# Altium schematic sheet Mainboard.SchDoc
size A4; SheetNumber: 1; SheetTotal: 2
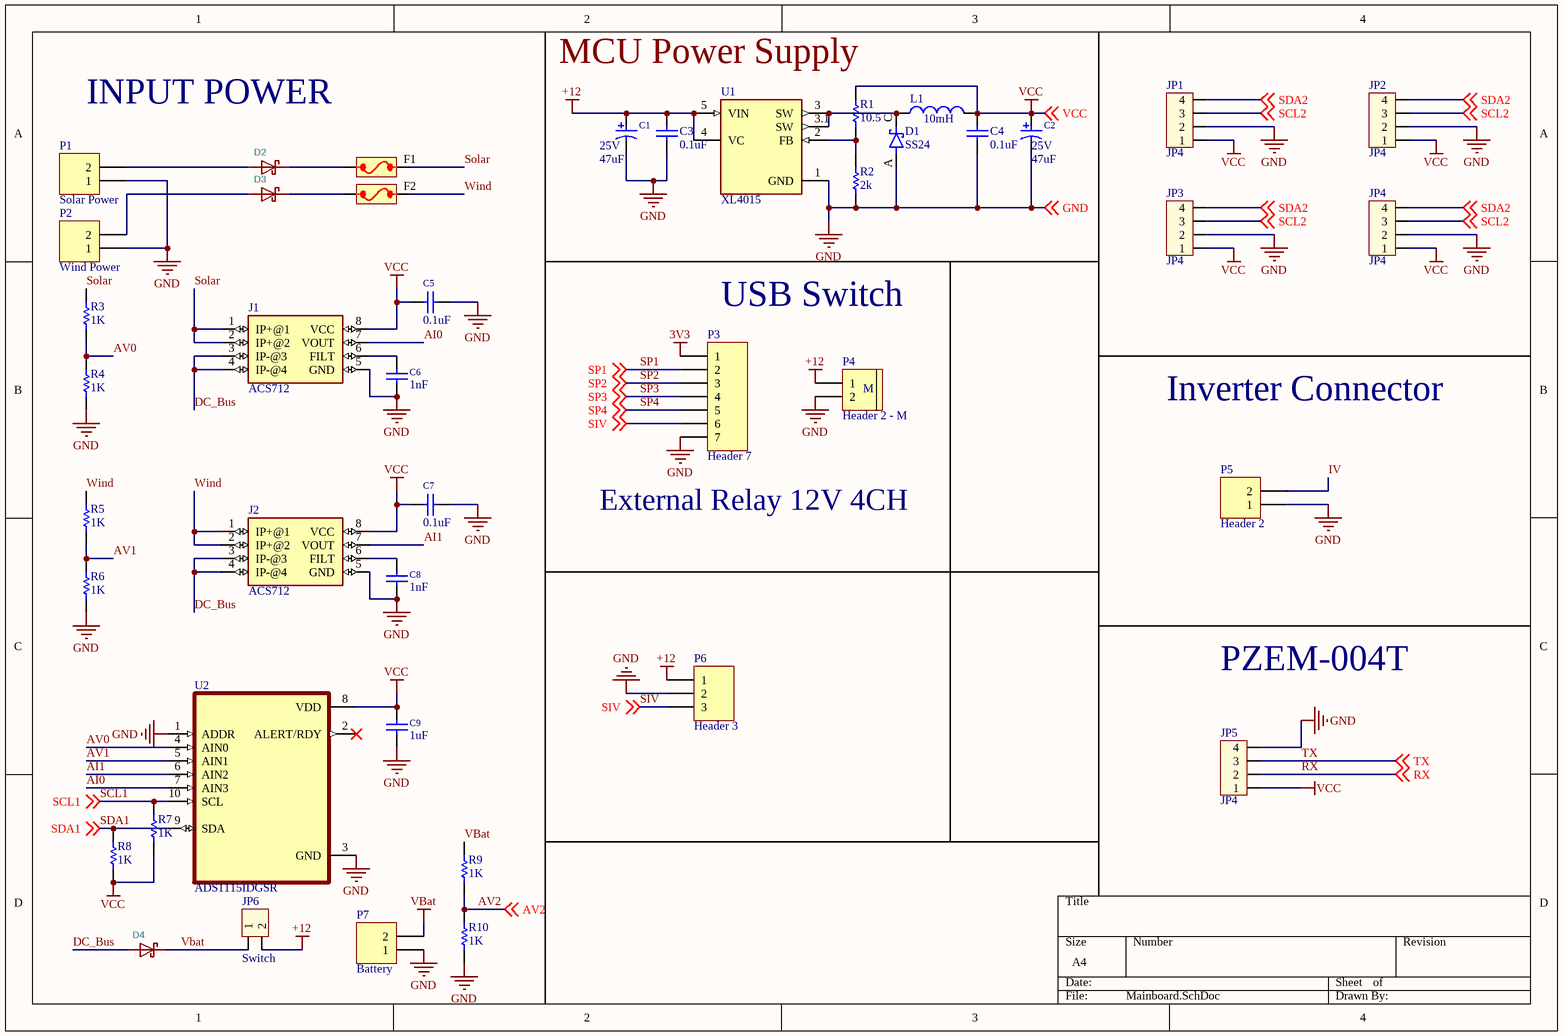
[diagram p0: Mainboard.SchDoc]

## Parts
C1  Volt: 25V  [CAP_SMD_6_3MM]  (hidden comment: 47uF)
C2  Volt: 25V  [CAP_SMD_6_3MM]  (hidden comment: 47uF)
C3  value 0.1uF  [C-NP-0805]  (hidden comment: Cap Non-pol)
C4  value 0.1uF  [C-NP-0805]  (hidden comment: Cap Non-pol)
C5  0.1uF  [C1608-0603]
C6  1nF  [C1608-0603]
C7  0.1uF  [C1608-0603]
C8  1nF  [C1608-0603]
C9  1uF  [C1608-0603]
D1  SS24  [DIOM5336X265N]
D2  (no value)  [D8x7,5]
D3  (no value)  [D8x7,5]
D4  (no value)  [D8x7,5]
F1  FUSE  [FUSE 24.5x9.5]  (value not drawn)
F2  FUSE  [FUSE 24.5x9.5]  (value not drawn)
J1  ACS712  [SO08]
J2  ACS712  [SO08]
JP1  JP4  [CON4]
JP2  JP4  [CON4]
JP3  JP4  [CON4]
JP4  JP4  [CON4]
JP5  JP4  [CON4]
JP6  Switch  [CON2]
L1  value 10mH  [INDUCTOR 12.5x12.5]  (hidden comment: Inductor)
P1  Solar Power  [PTBlock 2]
P2  Wind Power  [PTBlock 2]
P3  Header 7  [Header 7]
P4  Header 2 - M  [Medium - Header 2]
P5  Header 2  [PTBlock 2]
P6  Header 3  [Header 3]
P7  Battery  [PTBlock 2]
R1  value 10.5  [R-0805]  (hidden comment: RESISTOR)
R2  value 2k  [R-0805]  (hidden comment: RESISTOR)
R3  value 1K  [R-0805]  (hidden comment: RESISTOR)
R4  value 1K  [R-0805]  (hidden comment: RESISTOR)
R5  value 1K  [R-0805]  (hidden comment: RESISTOR)
R6  value 1K  [R-0805]  (hidden comment: RESISTOR)
R7  value 1K  [R-0805]  (hidden comment: RESISTOR)
R8  value 1K  [R-0805]  (hidden comment: RESISTOR)
R9  value 1K  [R-0805]  (hidden comment: RESISTOR)
R10  value 1K  [R-0805]  (hidden comment: RESISTOR)
U1  XL4015  [CONV_XL4015]
U2  ADS1115IDGSR  [SOP50P490X110-10N]

## Nets
3V3: P3.1
+12: C1.1 C3.2 JP6.2 P4.1 P6.1 U1.4(VC) U1.5(VIN)
GND: C1.2 C2.2 C3.1 C4.1 C5.1 C6.1 C7.1 C8.1 C9.2 D1.A J1.5(GND) J2.5(GND) JP1.2 JP2.2 JP3.2 JP4.2 JP5.4 P1.1 P2.1 P3.7 P4.2 P5.1 P6.2 P7.1 R2.1 R4.1 R6.1 R10.1 U1.1(GND) U2.1(ADDR) U2.3(GND) ; off-sheet GND
VBat: D4.K JP6.1 P7.2 R9.2
VCC: C2.1 C4.2 C5.2 C7.2 C9.1 J1.8(VCC) J2.8(VCC) JP1.1 JP2.1 JP3.1 JP4.1 JP5.1 L1.2 R1.2 R7.1 R8.1 U2.8(VDD) ; off-sheet VCC
AI0: J1.7(VOUT) U2.7(AIN3)
AI1: J2.7(VOUT) U2.6(AIN2)
AV0: R3.1 R4.2 U2.4(AIN0)
AV1: R5.1 R6.2 U2.5(AIN1)
AV2: R9.1 R10.2 ; off-sheet AV2
DC_Bus: D4.A J1.3(IP-@3) J1.4(IP-@4) J2.3(IP-@3) J2.4(IP-@4)
IV: P5.2
RX: JP5.2 ; off-sheet RX
SCL1: R7.2 U2.10(SCL) ; off-sheet SCL1
SCL2: JP1.3 JP2.3 JP3.3 JP4.3 ; off-sheet SCL2
SDA1: R8.2 U2.9(SDA) ; off-sheet SDA1
SDA2: JP1.4 JP2.4 JP3.4 JP4.4 ; off-sheet SDA2
SIV: P3.6 P6.3 ; off-sheet SIV
Solar: F1.2 J1.1(IP+@1) J1.2(IP+@2) R3.2
SP1: P3.2 ; off-sheet SP1
SP2: P3.3 ; off-sheet SP2
SP3: P3.4 ; off-sheet SP3
SP4: P3.5 ; off-sheet SP4
TX: JP5.3 ; off-sheet TX
Wind: F2.2 J2.1(IP+@1) J2.2(IP+@2) R5.2
NetC6_2: C6.2 J1.6(FILT)
NetC8_2: C8.2 J2.6(FILT)
NetD1_C: D1.C(K) L1.1 U1.3(SW) U1.3.1(SW)
NetD2_A: D2.A P1.2
NetD2_K: D2.K F1.1
NetD3_A: D3.A P2.2
NetD3_K: D3.K F2.1
NetR1_1: R1.1 R2.2 U1.2(FB)

Not connected (* = marked no-connect by the designer): U2 2(ALERT/RDY)*

## Notes on the sheet
- INPUT POWER
- USB Switch
- Inverter Connector
- (near P3) External Relay 12V 4CH
- PZEM-004T
- Labels drawn without touching a wire or pin: MCU Power Supply
- (in symbol Header 2 - M) M

## Library data of the parts
C1 C2 = Cap_Pol: Polarized Capacitor; Manufacturer: FARNELL; AEMS Code: 2100110; Vendor: Digikey; Published: 13-April-2009; Publisher: Hoang Nguyen; ComponentLink1Description: Digikey Part Link; ComponentLink2Description: Open Datasheet; ComponentLink2URL: H:\LIBRARY\LIBRARY.Datasheet\; Value: 47uF
C3 C4 = Cap Non-pol: Non-polarized Capacitor; Published: 8-Jun-2000; LatestRevisionDate: 17-Jul-2002; LatestRevisionNote: Re-released for DXP Platform.; PackageReference: RAD-0.3; Publisher: Altium Limited
C5-C9 = Capacitor: AEMS Code: 2100341; Vendor: Digikey; Volt: 16V; Published: 13-April-2009; Publisher: Hoang Nguyen; ComponentLink1Description: Digikey Part Link; ComponentLink2Description: Open Datasheet; ComponentLink2URL: H:\LIBRARY\LIBRARY.Datasheet\
  C5 C7: Value: 0.1uF
  C6 C8: Value: 1nF
  C9: Value: 1uF
D1 = SS24: Diode Schottky 40V 2A Surface Mount DO-214AA (SMB); MF: ON Semiconductor; Package: DO-214AA ON Semiconductor; Price: None; Value: *; SnapEDA_Link: https://www.snapeda.com/parts/SS24/Onsemi/view-part/?ref=snap; MP: SS24; Availability: In Stock; Check_prices: https://www.snapeda.com/parts/SS24/Onsemi/view-part/?ref=eda
D2-D4 = Schottky-Diode: ki_description: Schottky Diode; Datasheet: https://diotec.com/de/produktliste/SBD.html; ki_keywords: Schottky
F1 F2 = FUSE_1: Vendor: Digikey; Value: *; Published: 13-April-2009; Publisher: Hoang Nguyen; ComponentLink1Description: Digikey Part Link; ComponentLink2Description: Open Datasheet; ComponentLink2URL: H:\LIBRARY\LIBRARY.Datasheet\
J1 J2 = ACS712: Current Sensor 20A 1 Channel Hall Effect, Open Loop Bidirectional 8-SOIC (0.154, 3.90mm Width); MF: Allegro MicroSystems; SnapEDA_Link: https://www.snapeda.com/parts/ACS712/Allegro+MicroSystems+LLC/view-part/?ref=snap; Package: PowerWFQFN-12 Allegro MicroSystems LLC; Value: *; MP: ACS712; Check_prices: https://www.snapeda.com/parts/ACS712/Allegro+MicroSystems+LLC/view-part/?ref=eda
JP1-JP5 = Con4: Connector 4; Value: Connector 4
JP6 = Con2: Connector 2; Value: Connector 2
P1 P2 P5 P7 = Header 2: Header, 2-Pin; LatestRevisionDate: 17-Jul-2002; LatestRevisionNote: Re-released for DXP Platform.; Publisher: Altium Limited
P3 = Header 7: Header, 7-Pin; LatestRevisionDate: 17-Jul-2002; LatestRevisionNote: Re-released for DXP Platform.; Publisher: Altium Limited
P4 = Header 2 - M: Header, 2-Pin, Medium; LatestRevisionDate: 17-Jul-2002; LatestRevisionNote: Re-released for DXP Platform.; Publisher: Altium Limited
P6 = Header 3: Header, 3-Pin; LatestRevisionDate: 17-Jul-2002; LatestRevisionNote: Re-released for DXP Platform.; Publisher: Altium Limited
U1 = XL4015: 5A 180KHz 36V Buck DC to DC Converter; Price: None; MP: XL4015; Value: *; Availability: Unavailable; Package: None
U2 = ADS1115IDGSR: MP: altium_native_batch; Package: None; Price: None; Availability: Unavailable; Value: *
R1-R10 = RESISTOR: Published: 8-Jun-2000; LatestRevisionDate: 17-Jul-2002; LatestRevisionNote: Re-released for DXP Platform.; PackageReference: AXIAL-0.3; Publisher: Altium Limited